# EasyEDA schematic 03-ES7210-MIC.json
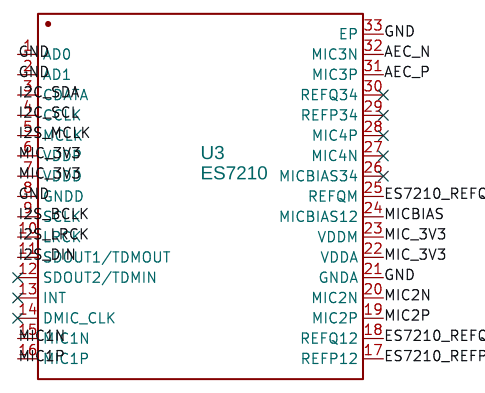
[diagram p0: schematic sheet]

## Parts
U3  ES7210  [QFN-32_L4.0-W4.0-P0.40-BL-EP2.7]

## Library data of the parts
U3 = -: Contributor: LCSC; Supplier: LCSC; Supplier Part: C365743; Manufacturer: Everest-semi(); JLCPCB Part Class: Extended Part

## Nets
GND: U3.1(AD0) U3.2(AD1) U3.8(GNDD) U3.21(GNDA) U3.33(EP)
AEC_N: U3.32(MIC3N)
AEC_P: U3.31(MIC3P)
ES7210_REFP12: U3.17(REFP12)
ES7210_REFQ12: U3.18(REFQ12)
ES7210_REFQM: U3.25(REFQM)
I2C_SCL: U3.4(CCLK)
I2C_SDA: U3.3(CDATA)
I2S_BCLK: U3.9(SCLK)
I2S_DIN: U3.11(SDOUT1/TDMOUT)
I2S_LRCK: U3.10(LRCK)
I2S_MCLK: U3.5(MCLK)
MIC1N: U3.15(MIC1N)
MIC1P: U3.16(MIC1P)
MIC2N: U3.20(MIC2N)
MIC2P: U3.19(MIC2P)
MIC_3V3: U3.6(VDDP) U3.7(VDDD) U3.22(VDDA) U3.23(VDDM)
MICBIAS: U3.24(MICBIAS12)

Not connected (* = marked no-connect by the designer): U3 12(SDOUT2/TDMIN)* 13(INT)* 14(DMIC_CLK)* 26(MICBIAS34)* 27(MIC4N)* 28(MIC4P)* 29(REFP34)* 30(REFQ34)*

## Notes on the sheet
- MEB AI Asistan - 3/5  ES7210 mikrofon ADC
- I2S saatleri ES8311 ile ortak. SDOUT -> I2S_DIN (GPIO10). Adres 0x40.
- MK1/MK2 MEMS mik C111990. LCSC Parcalari kutusuna C111990 yaz, iki tane koy.
- MIC1P/MIC2P -> ES7210. MICBIAS <- MICBIAS12. GND ortak.
